# EAGLE schematic Nano_to_I2CLCD (EAGLE 9.6.2)
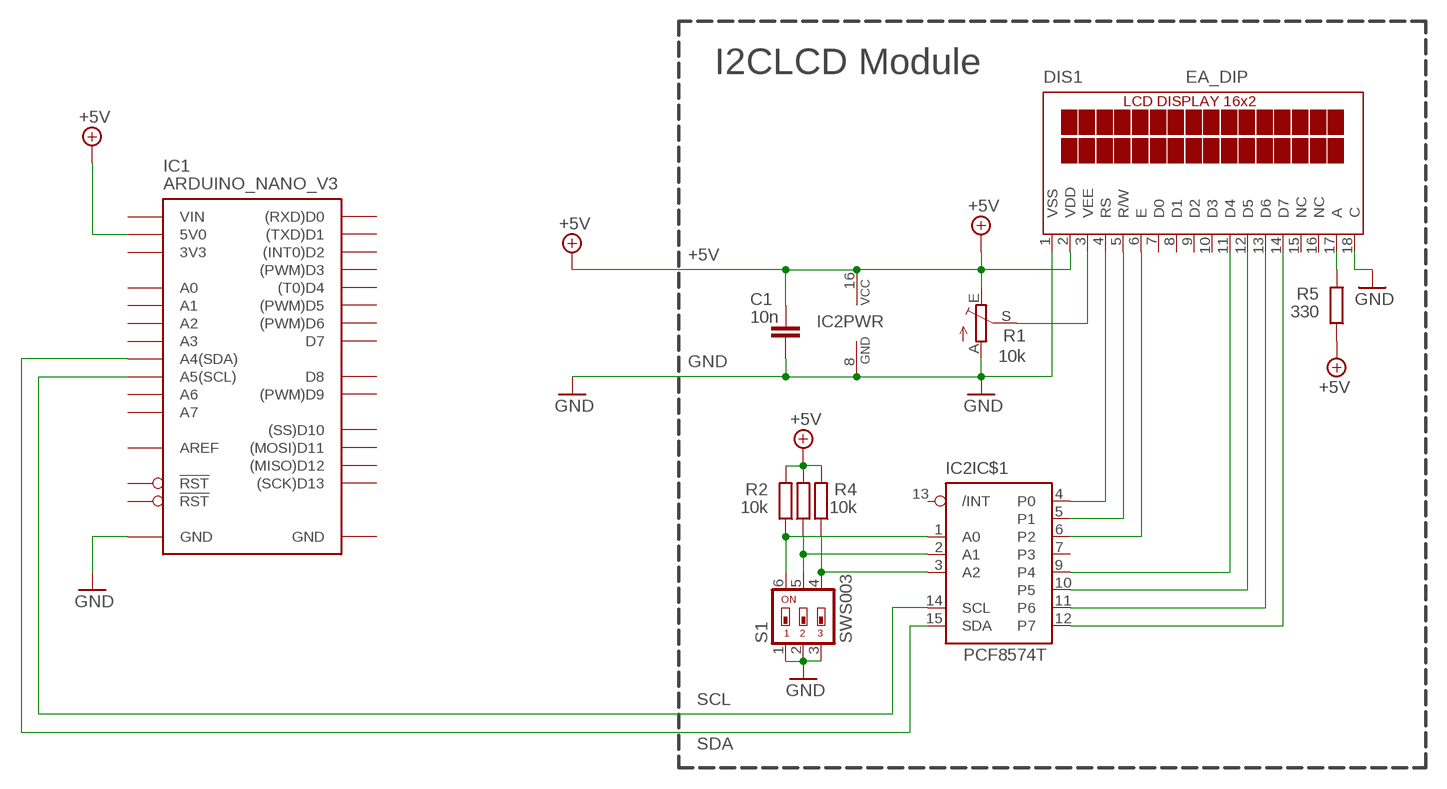
[diagram p0: schematic, sheet 1]

## Parts
C1  10n  C  (no package)
DIS1  EA_DIP  [EA_DIP]
IC1  ARDUINO_NANO_V3  [ARDUINO_NANO]
IC2  PCF8574T  [SO16]
R1  10k  TRIM_EU-B25P  [B25P]
R2  10k  R  (no package)
R3  10k  R  (no package)
R4  10k  R  (no package)
R5  330  R  (no package)
S1  SWS003  [SMS-003]

## Nets
+5V: C1.1 DIS1.2(VDD) IC1.12(5V0) IC2.16(PWR:VCC) R1.E R2.2 R3.2 R4.2 R5.1
GND: C1.2 DIS1.1(VSS) DIS1.18(C) IC1.14(GND) IC2.8(PWR:GND) R1.A S1.1 S1.2 S1.3
N$1: DIS1.4(RS) IC2.4(IC$1:P0)
N$2: DIS1.5(R/W) IC2.5(IC$1:P1)
N$3: DIS1.6(E) IC2.6(IC$1:P2)
N$4: DIS1.3(VEE) R1.S
N$5: DIS1.11(D4) IC2.9(IC$1:P4)
N$6: DIS1.12(D5) IC2.10(IC$1:P5)
N$7: DIS1.13(D6) IC2.11(IC$1:P6)
N$8: DIS1.14(D7) IC2.12(IC$1:P7)
N$10: DIS1.17(A) R5.2
N$11: IC2.1(IC$1:A0) R2.1 S1.6
N$12: IC2.2(IC$1:A1) R3.1 S1.5
N$13: IC2.3(IC$1:A2) R4.1 S1.4
N$14: IC1.8(A4(SDA)) IC2.15(IC$1:SDA)
N$15: IC1.9(A5(SCL)) IC2.14(IC$1:SCL)
Unconnected: DIS1.7(D0) DIS1.8(D1) DIS1.9(D2) DIS1.10(D3) DIS1.15(NC) DIS1.16(NC) IC1.1((SCK)D13) IC1.2(3V3) IC1.3(AREF) IC1.4(A0) IC1.5(A1) IC1.6(A2) IC1.7(A3) IC1.10(A6) IC1.11(A7) IC1.13(!RST) IC1.15(VIN) IC1.16((TXD)D1) IC1.17((RXD)D0) IC1.18(!RST) IC1.19(GND) IC1.20((INT0)D2) IC1.21((PWM)D3) IC1.22((T0)D4) IC1.23((PWM)D5) IC1.24((PWM)D6) IC1.25(D7) IC1.26(D8) IC1.27((PWM)D9) IC1.28((SS)D10) IC1.29((MOSI)D11) IC1.30((MISO)D12) IC2.7(IC$1:P3) IC2.13(IC$1:/INT)

## Notes on the sheet
- I2CLCD Module
- SCL
- SDA

## Library data of the parts
C1 = ngspice-simulation:C: CAPACITOR
DIS1 = display-lcd:EA_DIP: LCD-MODUL 2x16 - 6,68mm, INKL. KONTROLLER HD44780 Source: Data sheet <http://www.lcd-module.de/pdf/doma/dip162-d.pdf>
IC1 = Arduino_DWD:ARDUINO_NANO_V3
IC2 = i2c:PCF8574: Remote 8-Bit I/O Expander for I²C Bus
R1 = pot:TRIM_EU-: POTENTIOMETER
R2-R5 = ngspice-simulation:R: RESISTOR
S1 = smd-special:SWS003: SMD Dip Switch 3 pol.